# Altium project LTM-2405.PrjPcb
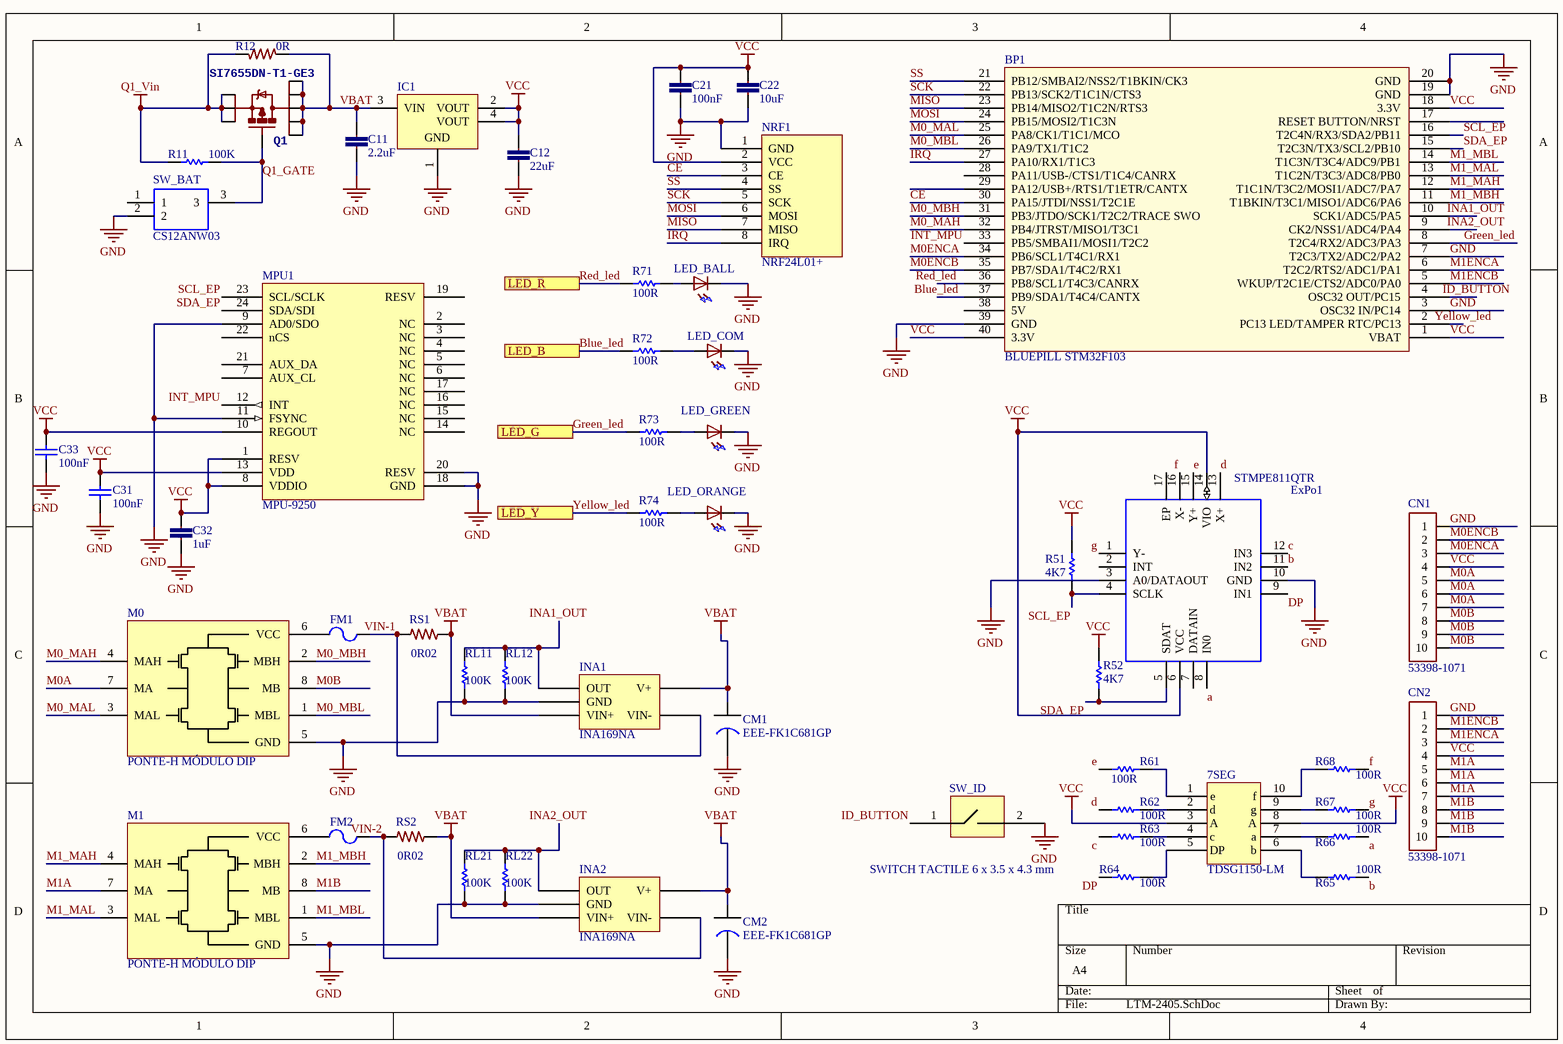
[diagram p0: LTM-2405.SchDoc]
1 sheet, 52 parts. Net scope: flat (ports and power ports of the same name join across sheets).
Board file: LTM-2405.PcbDoc

## Sheet LTM-2405.SchDoc
size A4

### Parts
7SEG  TDSG1150-LM  [7seg-pcb]
BP1  BLUEPILL STM32F103  [BLUEPILL-PCB]
C11  2.2uF  [1206-CAP]
C12  22uF  [1206-CAP]
C21  100nF  [0402-CAP]
C22  10uF  [1210-CAP]
C31  100nF  [CAPC0402(1005)60_N]
C32  1uF  [0402-CAP]
C33  100nF  [CAPC0402(1005)60_N]
CM1  EEE-FK1C681GP  [EEE-FK1C681GP]
CM2  EEE-FK1C681GP  [EEE-FK1C681GP]
CN1  53398-1071  [53398-10]
CN2  53398-1071  [53398-10]
ExPo1  STMPE811QTR  [QFN50P300X300X100-17N-D]
FM1  MF-MSMF030-2CT-ND  [RESC4632X16N]  (value not drawn)
FM2  MF-MSMF030-2CT-ND  [RESC4632X16N]  (value not drawn)
IC1  LD1117S33CTR  [SOT-223_N]  (value not drawn)
INA1  INA169NA  [SOT95P280X125-5N]
INA2  INA169NA  [SOT95P280X125-5N]
LED_BALL  LED  [LED-5MM-PCB]  (value not drawn)
LED_COM  LED  [LED-5MM-PCB]  (value not drawn)
LED_GREEN  LED  [LED-5MM-PCB]  (value not drawn)
LED_ORANGE  LED  [LED-5MM-PCB]  (value not drawn)
M0  PONTE-H MÓDULO DIP  [PONTEH-PCB]
M1  PONTE-H MÓDULO DIP  [PONTEH-PCB]
MPU1  MPU-9250  [MPU-9250]
NRF1  NRF24L01+  [NRF24L01P-PCB]
Q1  SI7655DN-T1-GE3  [SON8]
R11  100K  [RESC0402(1005)_L]
R12  0R  [0402-RES-HD]
R51  4K7  [RESC0402(1005)_L]
R52  4K7  [RESC0402(1005)_L]
R61  100R  [RESC0402(1005)_L]
R62  100R  [RESC0402(1005)_L]
R63  100R  [RESC0402(1005)_L]
R64  100R  [RESC0402(1005)_L]
R65  100R  [RESC0402(1005)_L]
R66  100R  [RESC0402(1005)_L]
R67  100R  [RESC0402(1005)_L]
R68  100R  [RESC0402(1005)_L]
R71  100R  [RESC0402(1005)_L]
R72  100R  [RESC0402(1005)_L]
R73  100R  [RESC0402(1005)_L]
R74  100R  [RESC0402(1005)_L]
RL11  100K  [RESC0402(1005)_L]
RL12  100K  [RESC0402(1005)_L]
RL21  100K  [RESC0402(1005)_L]
RL22  100K  [RESC0402(1005)_L]
RS1  0R02  [2512-RES-HD]
RS2  0R02  [2512-RES-HD]
SW_BAT  CS12ANW03  [CS12ANW03]
SW_ID  SWITCH TACTILE 6 x 3.5 x 4.3 mm  [PCBComponent]

### Ports
LED_B, LED_G, LED_R, LED_Y

### Nets
GND: BP1.3(OSC32_IN/PC14) BP1.7(T2C3/TX2/ADC2/PA2) BP1.19(GND) BP1.20(GND) BP1.39(GND) C11.2 C12.1 C21.2 C22.1 C31.1 C32.2 C33.1 CM1.2 CM2.2 CN1.1 CN2.1 ExPo1.3(A0/DATAOUT) ExPo1.10(GND) IC1.1(GND) INA1.2(GND) INA2.2(GND) LED_BALL.1(K) LED_COM.1(K) LED_GREEN.1(K) LED_ORANGE.1(K) M0.5(GND) M1.5(GND) MPU1.9(AD0/SDO) MPU1.11(FSYNC) MPU1.18(GND) MPU1.20(RESV) NRF1.1(GND) RL11.1 RL12.1 RL21.1 RL22.1 SW_BAT.2 SW_ID.2
Q1_Vin: Q1.1(S) Q1.2(S) Q1.3(S) R11.1 R12.2
VBAT: C11.1 CM1.1 CM2.1 IC1.3(VIN) INA1.3(VIN+) INA1.4(V+) INA2.3(VIN+) INA2.4(V+) Q1.5(D) Q1.6(D) Q1.7(D) Q1.8(D) Q1.9(D) R12.1 RS1.1 RS2.1
VCC: 7SEG.3(A) 7SEG.8(A) BP1.1(VBAT) BP1.18(3.3V) BP1.40(3.3V) C12.2 C21.1 C22.2 C31.2 C32.1 C33.2 CN1.4 CN2.4 ExPo1.6(VCC) ExPo1.14(VIO) IC1.2(VOUT) IC1.4(VOUT) MPU1.1(RESV) MPU1.8(VDDIO) MPU1.10(REGOUT) MPU1.13(VDD) NRF1.2(VCC) R51.2 R52.2
a: ExPo1.8(IN0) R66.2
b: ExPo1.11(IN2) R65.2
Blue_led: BP1.37(PB9/SDA1/T4C4/CANTX) R72.1 ; port LED_B
c: ExPo1.12(IN3) R63.1
CE: BP1.30(PA15/JTDI/NSS1/T2C1E) NRF1.3(CE)
d: ExPo1.13(X+) R62.1
DP: ExPo1.9(IN1) R64.1
e: ExPo1.15(Y+) R61.1
f: ExPo1.16(X-) R68.2
g: ExPo1.1(Y-) R67.2
Green_led: BP1.8(T2C4/RX2/ADC3/PA3) R73.1 ; port LED_G
ID_BUTTON: BP1.4(OSC32_OUT/PC15) SW_ID.1
INA1_OUT: BP1.10(SCK1/ADC5/PA5) INA1.1(OUT) RL11.2 RL12.2
INA2_OUT: BP1.9(CK2/NSS1/ADC4/PA4) INA2.1(OUT) RL21.2 RL22.2
INT_MPU: BP1.33(PB5/SMBAI1/MOSI1/T2C2) MPU1.12(INT)
IRQ: BP1.27(PA10/RX1/T1C3) NRF1.8(IRQ)
M0_MAH: BP1.32(PB4/JTRST/MISO1/T3C1) M0.4(MAH)
M0_MAL: BP1.25(PA8/CK1/T1C1/MCO) M0.3(MAL)
M0_MBH: BP1.31(PB3/JTDO/SCK1/T2C2/TRACE_SWO) M0.2(MBH)
M0_MBL: BP1.26(PA9/TX1/T1C2) M0.1(MBL)
M0A: CN1.5 CN1.6 CN1.7 M0.7(MA)
M0B: CN1.8 CN1.9 CN1.10 M0.8(MB)
M0ENCA: BP1.34(PB6/SCL1/T4C1/RX1) CN1.3
M0ENCB: BP1.35(PB7/SDA1/T4C2/RX1) CN1.2
M1_MAH: BP1.12(T1C1N/T3C2/MOSI1/ADC7/PA7) M1.4(MAH)
M1_MAL: BP1.13(T1C2N/T3C3/ADC8/PB0) M1.3(MAL)
M1_MBH: BP1.11(T1BKIN/T3C1/MISO1/ADC6/PA6) M1.2(MBH)
M1_MBL: BP1.14(T1C3N/T3C4/ADC9/PB1) M1.1(MBL)
M1A: CN2.5 CN2.6 CN2.7 M1.7(MA)
M1B: CN2.8 CN2.9 CN2.10 M1.8(MB)
M1ENCA: BP1.6(T2C2/RTS2/ADC1/PA1) CN2.3
M1ENCB: BP1.5(WKUP/T2C1E/CTS2/ADC0/PA0) CN2.2
MISO: BP1.23(PB14/MISO2/T1C2N/RTS3) NRF1.7(MISO)
MOSI: BP1.24(PB15/MOSI2/T1C3N) NRF1.6(MOSI)
Q1_GATE: Q1.4(G) R11.2 SW_BAT.3
Red_led: BP1.36(PB8/SCL1/T4C3/CANRX) R71.1 ; port LED_R
SCK: BP1.22(PB13/SCK2/T1C1N/CTS3) NRF1.5(SCK)
SCL_EP: BP1.16(T2C4N/RX3/SDA2/PB11) ExPo1.4(SCLK) MPU1.23(SCL/SCLK) R51.1
SDA_EP: BP1.15(T2C3N/TX3/SCL2/PB10) ExPo1.5(SDAT) MPU1.24(SDA/SDI) R52.1
SS: BP1.21(PB12/SMBAI2/NSS2/T1BKIN/CK3) NRF1.4(SS)
VIN-1: FM1.1 INA1.5(VIN-) RS1.2
VIN-2: FM2.1 INA2.5(VIN-) RS2.2
Yellow_led: BP1.2(PC13_LED/TAMPER_RTC/PC13) R74.1 ; port LED_Y
Net7SEG_1: 7SEG.1(e) R61.2
Net7SEG_2: 7SEG.2(d) R62.2
Net7SEG_4: 7SEG.4(c) R63.2
Net7SEG_5: 7SEG.5(DP) R64.2
Net7SEG_6: 7SEG.6(b) R65.1
Net7SEG_7: 7SEG.7(a) R66.1
Net7SEG_9: 7SEG.9(g) R67.1
Net7SEG_10: 7SEG.10(f) R68.1
NetFM1_2: FM1.2 M0.6(VCC)
NetFM2_2: FM2.2 M1.6(VCC)
NetLED_BALL_2: LED_BALL.2(A) R71.2
NetLED_COM_2: LED_COM.2(A) R72.2
NetLED_GREEN_2: LED_GREEN.2(A) R73.2
NetLED_ORANGE_2: LED_ORANGE.2(A) R74.2

Not connected (* = marked no-connect by the designer): BP1 17(RESET_BUTTON/NRST) 28(PA11/USB-/CTS1/T1C4/CANRX) 29(PA12/USB+/RTS1/T1ETR/CANTX) 38(5V); ExPo1 2(INT) 7(DATAIN) 17(EP); MPU1 2(NC) 3(NC) 4(NC) 5(NC) 6(NC) 7(AUX_CL) 14(NC) 15(NC) 16(NC) 17(NC) 19(RESV) 21(AUX_DA) 22(nCS); SW_BAT 1

### Library data of the parts
BP1 = BLUEPILL-1: STM32 Blue Pill Development Module
C11 = CC1206-2.2uF-8: CAP CER 2.2UF 50V X7R 1206; Part No: UMK316B7225KL-T; Cod EMS: 05.281.019.572; Value: 2.2u
C12 = CC1206-22uF-6.3V-1: CAP CER 22UF 6.3V 20% X5R 1206; Part No: C3216X5R0J226M085AC; Value: 22u; Rule: UNIONINDEX{}0[]RULEKIND{}PolygonConnect[]NETSCOPE{}AnyNet[]LAYERKIND{}SameLayer[]NAME{}Schematic Polygon Connect Style[]CONNECTSTYLE{}Direct[]RELIEFCONDUCTORWIDTH{}10mil[]RELIEFENTRIES{}4[]POLYGONRELIEFANGLE{}45 Angle[]AIRGAPWIDTH{}10mil[]UNIT{}Imperial[]PcbType{}ProtelPcb
C21 = CC0402-100nF-50v-A.3: CAP CER 0.1UF 50V 10% X7R 0402; Part No: C1005X7R1H104K050BB; Cod EMS: 05.281.019.021; Value: 100n
C22 = CC1210-10uF-6: CAP CER 10UF 50V 20% X5R 1210; Part No: UMK325BJ106MM; value: 10u; Cod EMS: 05.281.019.522
C31 C33 = CMP-1034-02065-1: CAP 100nF 10V ±10% 0402 (1005 Metric) Thickness 0.6mm SMD; Case-EIA: 0402; Case-Metric: 1005; Tolerance: Â±10%; Max Thickness: 0.6 mm; Value: 100nF; Rated Voltage: 10 V; Technology: SMT
C32 = CC0402-1uF-5: CAP CER 1UF 6.3V 10% X5R 0402; Part No: JMK105BJ105KV-F; Cod EMS: 05.281.019.513; Value: 1u
CM1 CM2 = CAP AL 680UF/16V: Aluminum Electrolytic Capacitors - SMD Al Lytic Cap SMT FK Series 105C
CN1 CN2 = 53398-1071-2: CONN HEADER 10POS 1.25MM VRT SMD; Cod EMS: 05.285.005.202; Part No: 53398-1071
ExPo1 = STMPE811QTR: Interface - I/O Expanders 8-BIT PORT EXPANDER W/ADV TOUCHSCREEN; Manufacturer_Name: STMicroelectronics; Geometry.Height: 1mm; Manufacturer_Part_Number: STMPE811QTR; RS Part Number: 1658056; RS Price/Stock: http://uk.rs-online.com/web/p/products/1658056; Arrow Part Number: STMPE811QTR; Arrow Price/Stock: https://www.arrow.com/en/products/stmpe811qtr/stmicroelectronics; Datasheet Link: http://docs-europe.electrocomponents.com/webdocs/0edc/0900766b80edc3b7.pdf
FM1 FM2 = MF-MSMF250/16X-01.A.2: FUSE PTC RESETTBL .30A 30V 1812
IC1 = CMP-0244-00307-1: Fixed Low Drop Positive Voltage Regulator, 3.3V, 4-Pin SOT-223, Tape and Reel; ComponentLink1URL: http://www.st.com; PackageVersion: 2010; ComponentLink1Description: Manufacturer URL; DatasheetVersion: 1/11/2011; ComponentLink2URL: http://www.st.com/internet/com/TECHNICAL_RESOURCES/TECHNICAL_LITERATURE/DATASHEET/CD00000544.pdf; PackageReference: SOT-223; ComponentLink2Description: Datasheet; PackageDescription: 4-Pin SOT-223 Package, 6.5 x 3.5 mm Body, 2.3 mm Pitch, 7 mm Lead Span
INA1 INA2 = INA169NA-01.A.1: IC CURRENT MONITOR 0.5% SOT23-5
LED_BALL LED_COM LED_GREEN LED_ORANGE = LED-5MM-3: LED 5MM PTH
M0 M1 = PONTEH-1: MÓDULO PONTE H DIP ROBOIME
MPU1 = MPU-9250-1: IMU ACCEL/GYRO/MAG I2C/SPI 24QFN; Part No: MPU-9250
NRF1 = NRF24L01P-1: Packaging: Tray
Q1 = SI7655DN-T1-GE3-3: MOSFET P-CH 20V D-S PPAK 1212; Cod EMS: 05.284.001.520; Part No: SI7655DN-T1-GE3
R11 RL11 RL12 RL21 RL22 = CMP-1011-00736-1: 100K 0.063W 1% 0402 (1005 Metric)  SMD; Value: 100000.00 Ohm; Case-EIA: 0402; Case-Metric: 1005; Power: 0.063 W; Tolerance: 1 %; Technology: SMT
R12 = R0402-0R-7: RES 0.0 OHM 1/16W JUMP 0402 SMD; Part No: CRCW04020000Z0ED; Cod EMS: 05.280.029.528; Value: 0
R51 R52 = CMP-1011-00586-1: 4K7 0.063W 1% 0402 (1005 Metric)  SMD; Case-Metric: 1005; Value: 4700.00 Ohm; Case-EIA: 0402; Power: 0.063 W; Technology: SMT; Tolerance: 1 %
R61-R68 R71-R74 = CMP-1011-00397-1: 100R 0.063W 1% 0402 (1005 Metric)  SMD; Case-EIA: 0402; Case-Metric: 1005; Value: 100.00 Ohm; Technology: SMT; Tolerance: 1 %; Power: 0.063 W
RS1 RS2 = R2512-0R02-4: RES .02 OHM 2W 1% 2512 SMD; Part No: WSL2512R0200FEA18; Cod EMS: 05.280.029.529; Value: 0.02; Family Description: RESISTOR SENTIDO DE CORRENTE 0,010R-0,040R/ 2W / 1% / 2512 P/N: WSL2512.....FEA18 – VISHAY DALE.; Family: WSL2512.....FEA18
SW_BAT = CS12ANW03: NKK SWITCHES - CS12ANW03 - SWITCH, SLIDE, SPDT, 3A, 250V, TH; Allied_Number: 70228233; Manufacturer_Name: NKK Switches; Manufacturer_Part_Number: CS12ANW03; RS Part Number: 1251847; RS Price/Stock: http://uk.rs-online.com/web/p/products/1251847; Allied Price/Stock: https://www.alliedelec.com/nkk-switches-cs12anw03/70228233/; Arrow Part Number: CS12ANW03; Arrow Price/Stock: https://www.arrow.com/en/products/cs12anw03/nkk-switches; Datasheet Link: http://www.nkkswitches.com/pdf/cs.pdf
SW_ID = 95C04A3GWRT.-1: GRAYHILL TACT,GW,6X3.5,1800T&R,LF Eight, 160g Operating Force, Gull Wing, RoHS Compliant; Part No: 95C04A3GWRT